# EAGLE design H1BR6 (EAGLE 9.6.1)

## Sheet 1 of 2
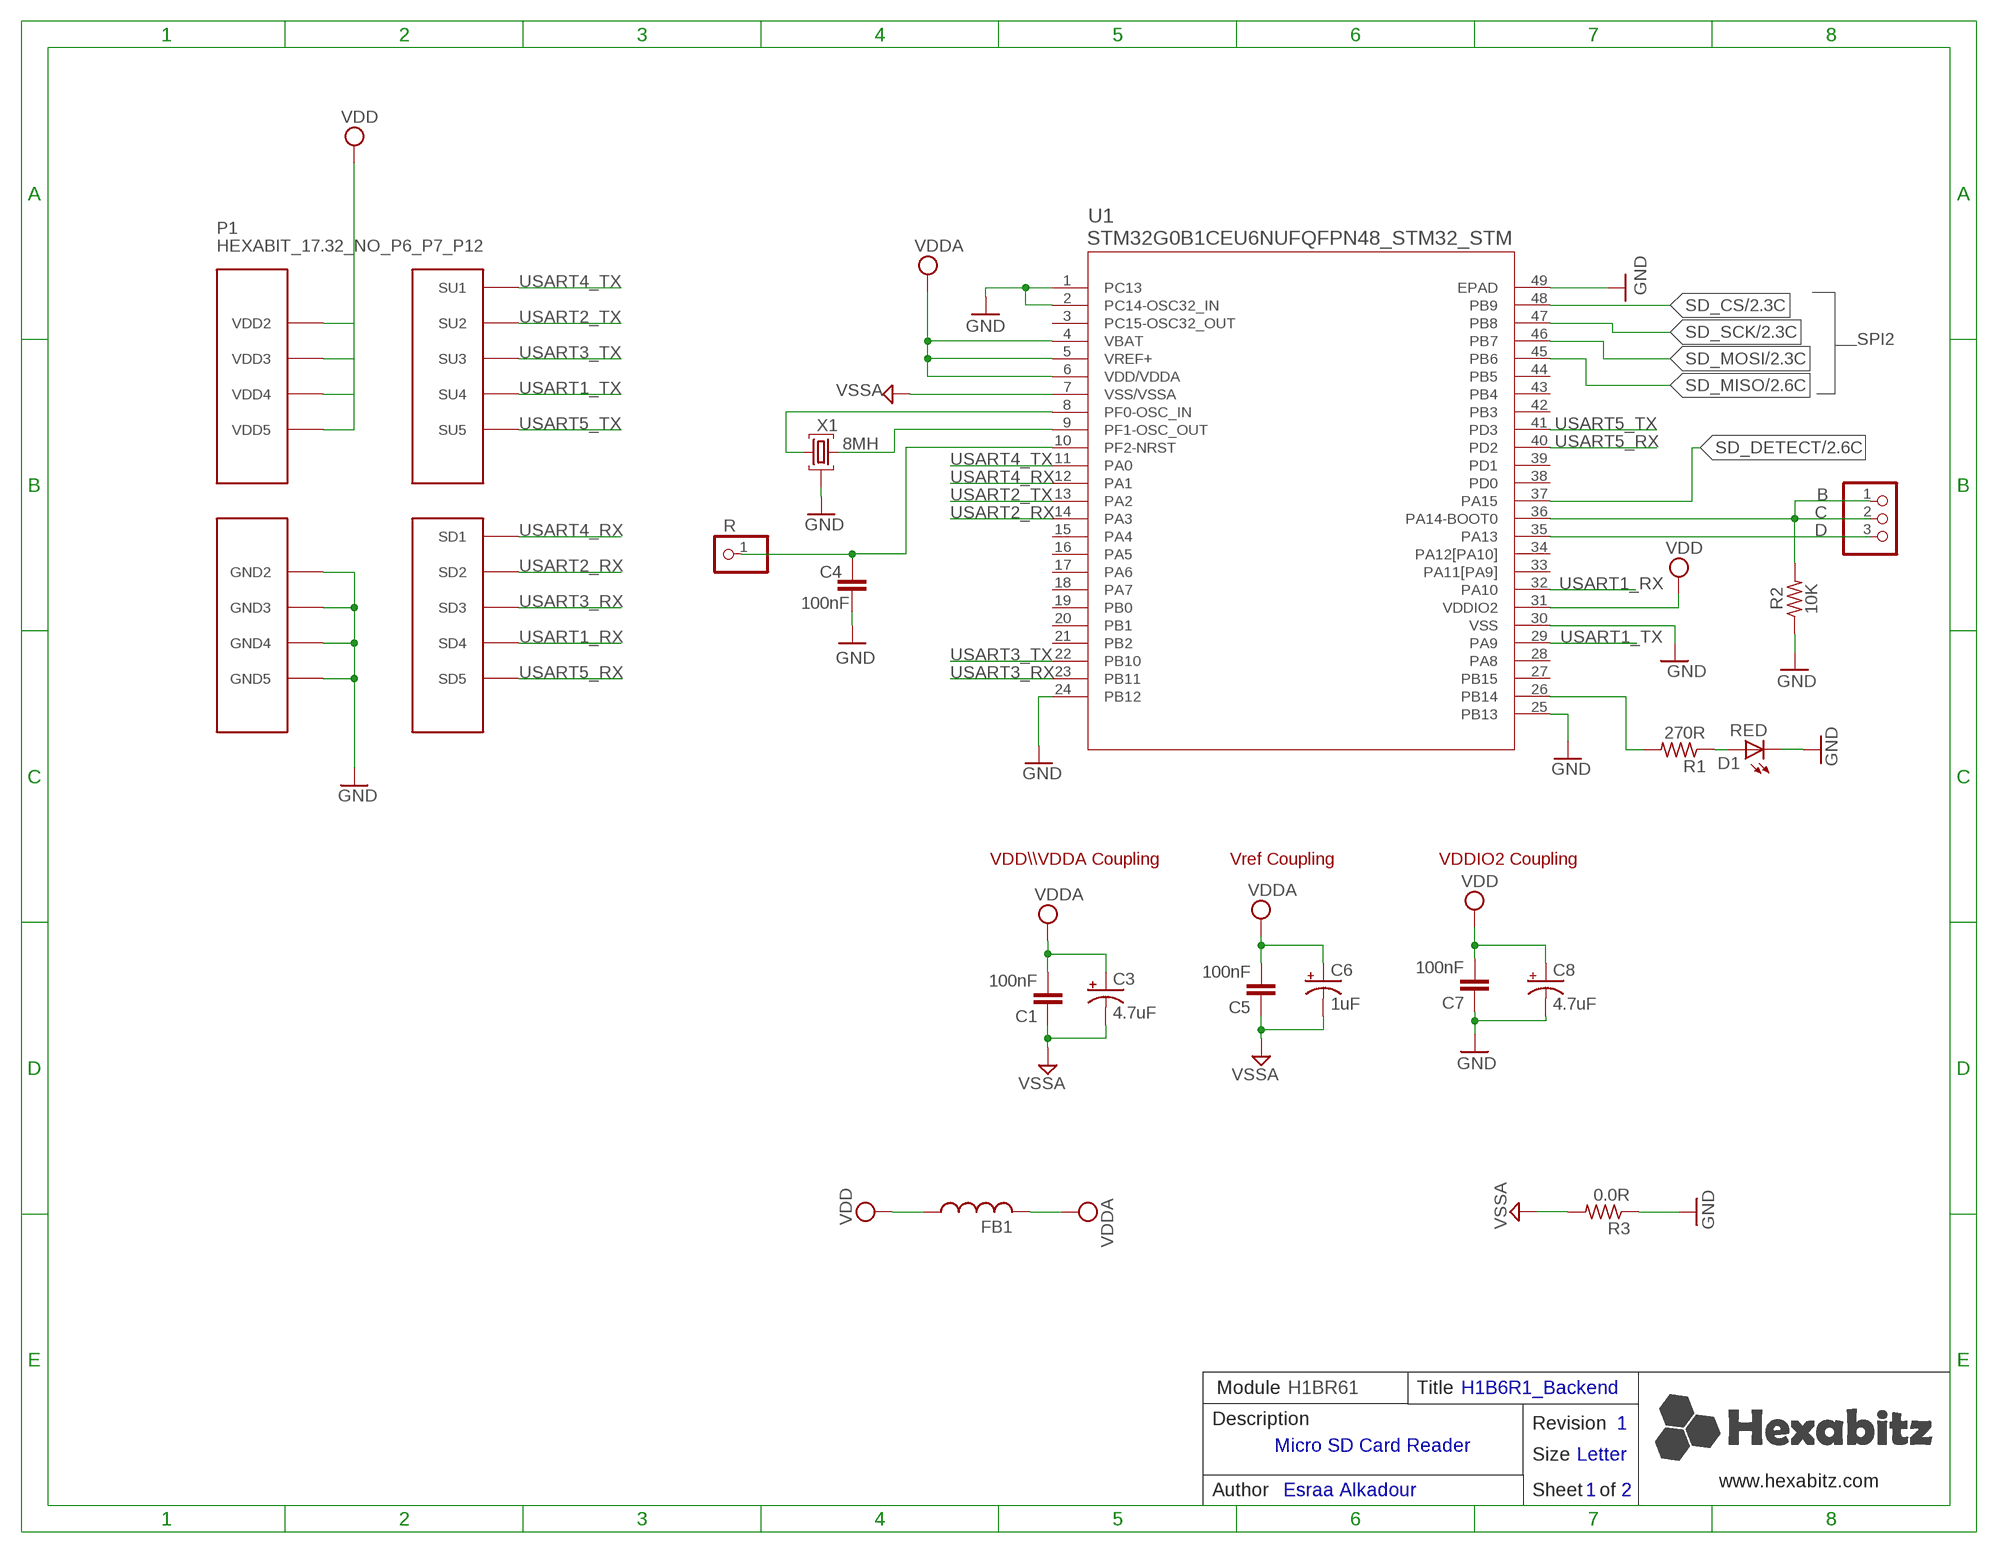
[diagram p0: schematic, sheet 1]

### Parts
C1  100nF  C-0603  [C-0603]
C3  4.7uF  C-0805-POL  [C-0805-POL]
C4  100nF  C-0603  [C-0603]
C5  100nF  C-0603  [C-0603]
C6  1uF  C-0805-POL  [C-0805-POL]
C7  100nF  C-0603  [C-0603]
C8  4.7uF  C-0805-POL  [C-0805-POL]
D1  RED  VLMS1300-GS08  [VLMS1300-GS08]
FB1  FB-TDK_MMZ1608Y300B  [FB-TDK_MMZ1608Y300B]
J4  PINHD-1X1  [1X01]
JP1  PINHD-1X3  [1X03]
P1  HEXABIT_17.32_NO_P6_P7_P12  [HEXABIT_17.32_NO_P6_P7_P12]
R1  270R  R-0603  [R-0603]
R2  10K  R-0603  [R-0603]
R3  0.0R  R-0603  [R-0603]
U1  STM32G0B1CEU6NUFQFPN48_STM32_STM  [UFQFPN48_STM32_STM]
X1  8MH  XTALL_CSTCE8M00G52  [XTALL_CSTCE8M00G52]

### Nets
C: JP1.1 JP1.2 R2.2 U1.36(PA14-BOOT0)
D: JP1.3 U1.35(PA13)
GND: C4.1 C7.1 C8.2(-) D1.C P1.PAD_PD8(GND2) P1.PAD_PD9(GND3) P1.PAD_PD10(GND4) P1.PAD_PD11(GND5) R2.1 R3.1 U1.1(PC13) U1.2(PC14-OSC32_IN) U1.24(PB12) U1.25(PB13) U1.30(VSS) U1.49(EPAD) X1.P$2 ; also sheet 2
GND1: C1.1 C3.2(-) C5.1 C6.2(-) R3.2 U1.7(VSS/VSSA) ; supply symbol labelled VSSA
N$1: U1.8(PF0-OSC_IN) X1.P$3
N$2: U1.9(PF1-OSC_OUT) X1.P$1
N$17: R1.2 U1.26(PB14)
N$19: D1.A R1.1
R: C4.2 J4.1 U1.10(PF2-NRST)
SD_CS: U1.48(PB9) ; also sheet 2
SD_DETECT: U1.37(PA15) ; also sheet 2
SD_MISO: U1.45(PB6) ; also sheet 2
SD_MOSI: U1.46(PB7) ; also sheet 2
SD_SCK: U1.47(PB8) ; also sheet 2
USART1_RX: P1.PAD_PD4(SD4) U1.32(PA10)
USART1_TX: P1.PAD_PU4(SU4) U1.29(PA9)
USART2_RX: P1.PAD_PD2(SD2) U1.14(PA3)
USART2_TX: P1.PAD_PU2(SU2) U1.13(PA2)
USART3_RX: P1.PAD_PD3(SD3) U1.23(PB11)
USART3_TX: P1.PAD_PU3(SU3) U1.22(PB10)
USART4_RX: P1.PAD_PD1(SD1) U1.12(PA1)
USART4_TX: P1.PAD_PU1(SU1) U1.11(PA0)
USART5_RX: P1.PAD_PD5(SD5) U1.40(PD2)
USART5_TX: P1.PAD_PU5(SU5) U1.41(PD3)
VCC: C1.2 C3.1(+) C5.2 C6.1(+) FB1.2 U1.4(VBAT) U1.5(VREF+) U1.6(VDD/VDDA) ; supply symbol labelled VDDA
VDD: C7.2 C8.1(+) FB1.1 P1.PAD_PU8(VDD2) P1.PAD_PU9(VDD3) P1.PAD_PU10(VDD4) P1.PAD_PU11(VDD5) U1.31(VDDIO2) ; also sheet 2
Unconnected: U1.3(PC15-OSC32_OUT) U1.15(PA4) U1.16(PA5) U1.17(PA6) U1.18(PA7) U1.19(PB0) U1.20(PB1) U1.21(PB2) U1.27(PB15) U1.28(PA8) U1.33(PA11[PA9]) U1.34(PA12[PA10]) U1.38(PD0) U1.39(PD1) U1.42(PB3) U1.43(PB4) U1.44(PB5)

### Notes on the sheet
- SPI2
- B
- R
- VDD\\\VDDA Coupling | Vref Coupling | VDDIO2 Coupling
- Module | H1BR61 | Title | H1B6R1_Backend
- Description | Revision | 1
- Micro SD Card Reader
- Size | Letter
- www.hexabitz.com
- Author | Esraa Alkadour | Sheet   of | 1 | 2
- C:/Users/Admin/Desktop/logodraft.bmp

## Sheet 2 of 2
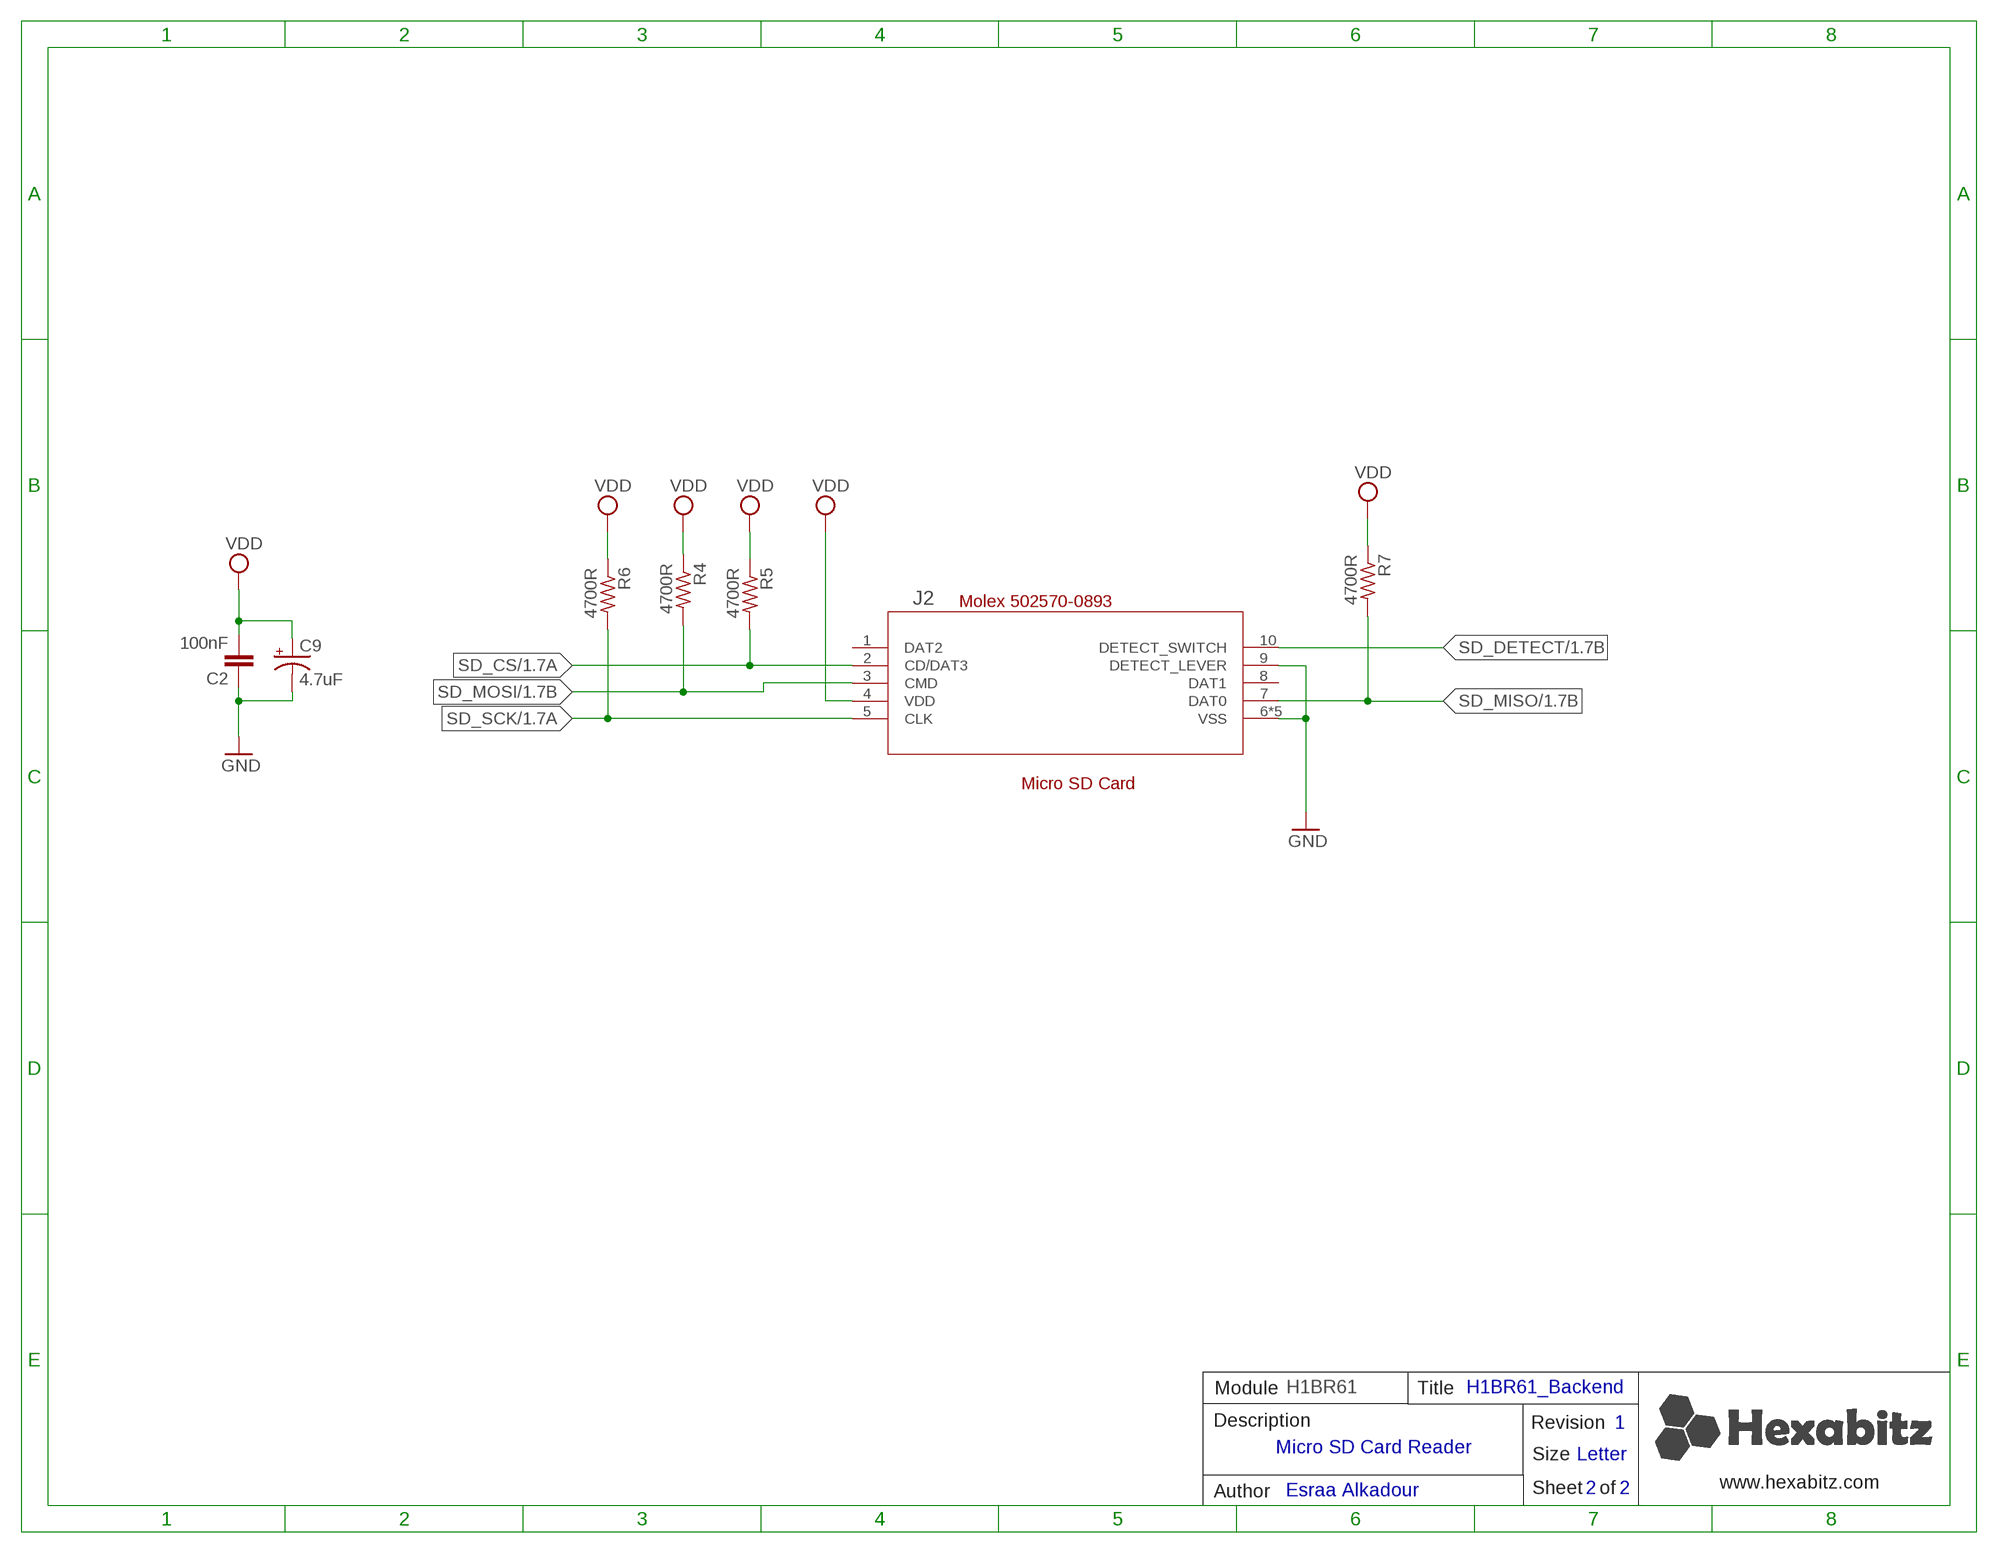
[diagram p1: schematic, sheet 2]

### Parts
C2  100nF  C-0603  [C-0603]
C9  4.7uF  C-0805-POL  [C-0805-POL]
J2  5025700893502570-0893_MOL  [502570-0893_MOL]
R4  4700R  R-0603  [R-0603]
R5  4700R  R-0603  [R-0603]
R6  4700R  R-0603  [R-0603]
R7  4700R  R-0603  [R-0603]

### Nets
GND: C2.1 C9.2(-) J2.6(VSS) J2.9(DETECT_LEVER) J2.11(VSS) J2.12(VSS) J2.13(VSS) J2.14(VSS) ; also sheet 1
SD_CS: J2.2(CD/DAT3) R5.2 ; also sheet 1
SD_DETECT: J2.10(DETECT_SWITCH) ; also sheet 1
SD_MISO: J2.7(DAT0) R7.2 ; also sheet 1
SD_MOSI: J2.3(CMD) R4.2 ; also sheet 1
SD_SCK: J2.5(CLK) R6.2 ; also sheet 1
VDD: C2.2 C9.1(+) J2.4(VDD) R4.1 R5.1 R6.1 R7.1 ; also sheet 1
Unconnected: J2.1(DAT2) J2.8(DAT1)

### Notes on the sheet
- Molex 502570-0893
- Micro SD Card
- Module | H1BR61 | Title | H1BR61_Backend
- Description | Revision | 1
- Micro SD Card Reader
- Size | Letter
- www.hexabitz.com
- Author | Esraa Alkadour | Sheet   of | 2 | 2

## Library data of the parts
C1 C2 C5 C7 = HEXABITZ_RCLS:C-0603: CAP CER 10% X7R 0603; CAPACITANCE: 100nF; MFN: AVX CORPORATION; MPN: '0603YC104K4T2A; OCTOPART_URL: 'https://octopart.com/0603yc104k4t2a-avx+interconnect+%2F+elco-8120651; TOLERANCE: 10%; VOLTAGE_RATING: 16.0 V
C3 C9 = HEXABITZ_RCLS:C-0805-POL: Cap Tant Solid SMD 2012; CAPACITANCE: 4.7uF; MFN: 'Panasonic; MPN: '10TPU4R7MSI; OCTOPART_URL: https://octopart.com/10tpu4r7msi-panasonic-29487748?r=sp; TOLERANCE: 20%; VOLTAGE_RATING: 10.0 V
C4 = HEXABITZ_RCLS:C-0603: CAP CER 10% X7R 0603; CAPACITANCE: 100nF; MFN: AVX CORPORATION; MPN: 0603YC104K4T2A; OCTOPART_URL: 'https://octopart.com/0603yc104k4t2a-avx+interconnect+%2F+elco-8120651; TOLERANCE: 10%; VOLTAGE_RATING: 16.0 V
C6 = HEXABITZ_RCLS:C-0805-POL: Cap Tant Solid SMD 2012; CAPACITANCE: 4.7uF; MFN: 'YAGEO [VA]; MPN: 'CC0805KKX7R7BB105; OCTOPART_URL: 'https://octopart.com/cc0805kkx7r7bb105-yageo-8376555?r=sp; TOLERANCE: 20%; VOLTAGE_RATING: 10.0 V
C8 = HEXABITZ_RCLS:C-0805-POL: Cap Tant Solid SMD 2012; CAPACITANCE: 1.00uF; MFN: 'Panasonic; MPN: '10TPU4R7MSI; OCTOPART_URL: https://octopart.com/10tpu4r7msi-panasonic-29487748?r=sp; TOLERANCE: 10%; VOLTAGE_RATING: 16.0 V
D1 = HEXABITZ_USER_INTERFACE_PARTS:VLMS1300-GS08: Red 0603 130° Clear 54 mcd 2 V Surface Mount ChipLED ; Octopart Url : http://octopart.com/vlms1300-gs08-vishay-21709201; MFN: Vishay; MPN: VLMS1300-GS08; OCTOPART_URL: https://octopart.com/vlms1300-gs08-vishay-21709201?r=sp&s=0nXJNjGsSbWwqfqWlZv0EA
FB1 = HEXABITZ_RCLS:FB-TDK_MMZ1608Y300B: Ferrite Beads Multi-Layer 30Ohm 25% 100MHz 1.5A 50mOhm DCR 0603; MFN: TDK; MPN: MMZ1608Y300BTA00; OCTOPART_URL: https://octopart.com/mmz1608y300bta00-tdk-7906990?r=sp
J2 = HEXABITZ_CONNECTION_PARTS:5025700893; COPYRIGHT: Copyright (C) 2022 Ultra Librarian. All rights reserved.; DIGI-KEY_PART_NUMBER_1: WM19093TR-ND; DIGI-KEY_PART_NUMBER_2: WM19093CT-ND; DIGI-KEY_PART_NUMBER_3: WM19093DKR-ND; DIGI-KEY_PART_NUMBER_4: WM19093TR-NDL; MANUFACTURER_PART_NUMBER: 5025700893; MFR_NAME: Molex Connector Corporation; OCTOPART_URL: https://octopart.com/502570-0893-molex-42270318?r=sp
J4 = HEXABITZ_USER_INTERFACE_PARTS:PINHD-1X1: PIN HEADER; MFN: TE Connectivity; MPN: 87227-1; OCTOPART_URL: https://octopart.com/87227-1-te+connectivity-39512052?r=sp
JP1 = pinhead:PINHD-1X3: PIN HEADER
P1 = hexabitz_connectors:HEXABIT_?_NO_P6_P7_P12: Hexabitz Hexagon Module Connector Hexagon side length = 17.32mm. The following ports are removed: P6 P7 P12
R1 = HEXABITZ_RCLS:R-0603: Thick Film Resistors - SMD 0603; MFN: 'Panasonic; MPN: 'ERJ-3GEYJ271V; OCTOPART_URL: https://octopart.com/erj-3geyj271v-panasonic-55560546?r=sp; RESISTANCE: 270R
R2 = HEXABITZ_RCLS:R-0603: Thick Film Resistors - SMD 0603; MFN: Vishay; MPN: '060300J0103T5E; OCTOPART_URL: https://octopart.com/search?q=060300J0103T5E&currency=USD&specs=0; RESISTANCE: 10K
R3 = HEXABITZ_RCLS:R-0603: Thick Film Resistors - SMD 0603; MFN: YAGEO [VR]; MPN: RC0603JR-070RL; OCTOPART_URL: https://octopart.com/rc0603jr-070rl-yageo-1241539?r=sp; RESISTANCE: 0R
R4-R7 = HEXABITZ_RCLS:R-0603: Thick Film Resistors - SMD 0603; MFN: YAGED [VA]; MPN: RC0603JR-074K7L; OCTOPART_URL: 'https://octopart.com/rc0603jr-074k7l-yageo-55458509?r=sp; RESISTANCE: 4700 Ohm; TOLERANCE: 5%
U1 = HEXABITZ_ICs:STM32G0B1CEU6N; COPYRIGHT: Copyright (C) 2022 Ultra Librarian. All rights reserved.; MFN: STMicroelectronics; MPN: STM32G0B1CEU6N; OCTOPART_URL: https://octopart.com/stm32g0b1ceu6n-stmicroelectronics-116364672?r=sp
X1 = HEXABITZ_OTHER_PARTS:XTALL_CSTCE8M00G52: MURATA CSTCE8M00G52-R0 RESONATOR, SMD, 8MHZ ; Octopart Url : https://octopart.com/cstce8m00g52-r0-murata-7145559; MFN: Murata; MPN: CSTNE8M00G550000R0; OCTOPART_URL: https://octopart.com/cstne8m00g550000r0-murata-91406934?r=sp

## Board
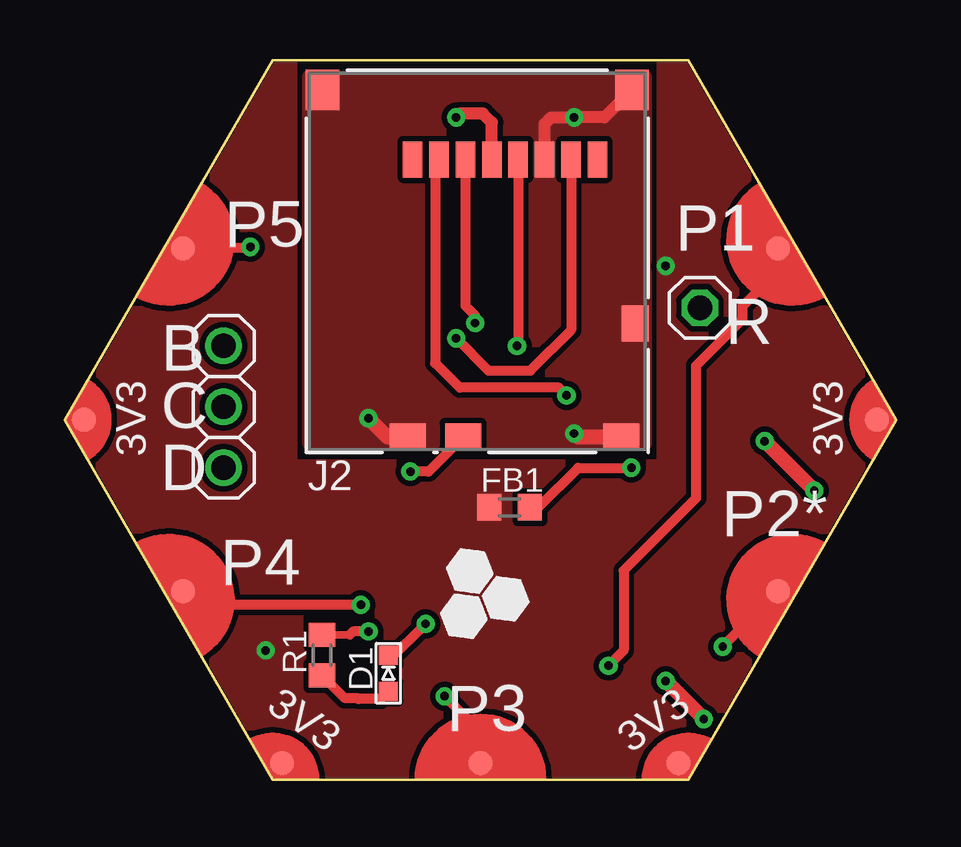
[diagram p2: board, top side]
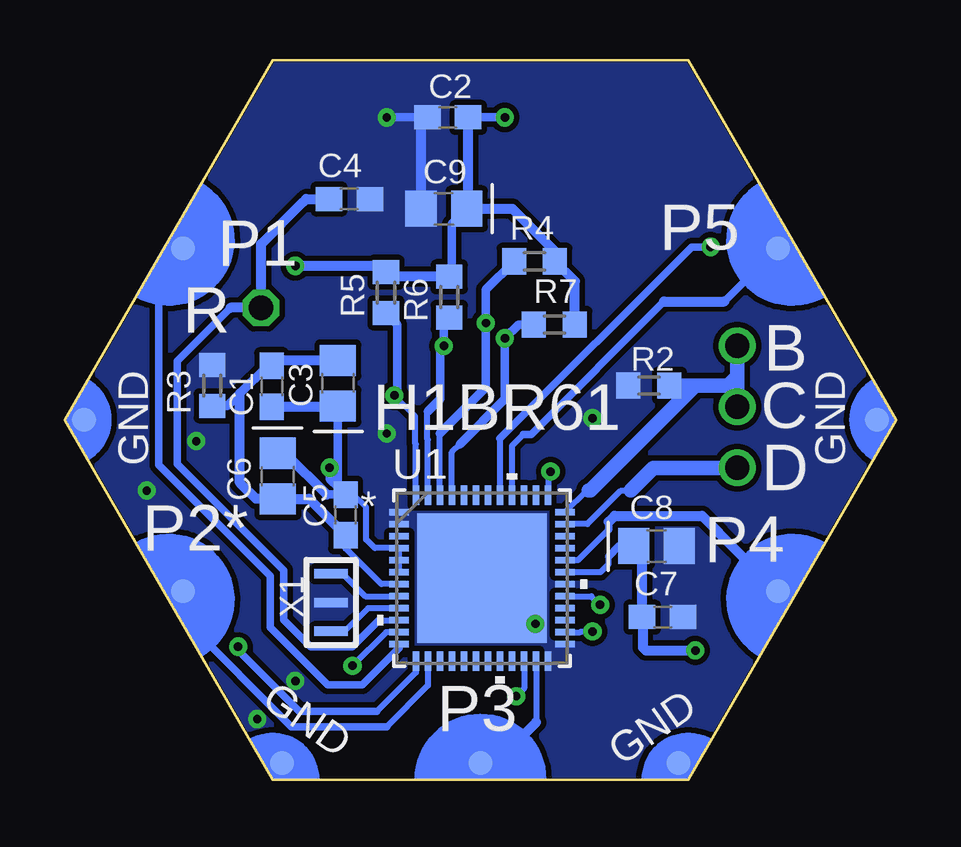
[diagram p3: board, bottom side, seen from below]

Size 34.64 x 30 mm. Coordinates in mm from the lower left corner, seen from the top.
Copper layers (1*16): Top 0.035mm / dielectric 1.5mm / Bottom 0.035mm
Design rules "2_layer *": minimum track width 7mil, minimum drill 10mil, track to track 9mil, track to pad 9mil, pad to pad 9mil, via to via 9mil, smd to smd 0mil, copper to edge 1mil, drill to drill 8mil, minimum pad ring 10mil, minimum via ring 8mil, stop-mask expansion 2mil, vias tented up to drill 15mil, thermal gap 10mil

### Footprints (pad centres in the part's own frame; a part is rotated, then mirrored left to right if it is on the bottom)
C-0603 = smd 1.1 x 1: 1 -0.85,0; 2 0.85,0
C-0805-POL = smd 1.3 x 1.5: 1 -0.95,0; 2 0.95,0
VLMS1300-GS08 = smd 0.8 x 0.8: A 0,0.75; C 0,-0.75
FB-TDK_MMZ1608Y300B = smd 1 x 1.1: 1 -0.85,0; 2 0.85,0
502570-0893_MOL = smd 0.813 x 1.499: 1 -2.7,4.249; 2 -1.6,4.249; 3 -0.5,4.249; 4 0.6,4.249; 5 1.7,4.249; 6 2.8,4.249; 7 3.9,4.249; 8 5,4.249 | smd 1.143 x 1.499: 9 6.575,-2.601 | smd 1.499 x 1.143: 10 -0.6,-7.326; 13 -2.9,-7.326; 14 6,-7.326 | smd 1.397 x 1.702: 11 -6.45,7.149; 12 6.45,7.149
1X01 = drill 1.016 octagon: 1 0,0
1X03 = drill 1.016: 1 -2.54,0; 2 0,0; 3 2.54,0
HEXABIT_17.32_NO_P6_P7_P12 = smd 1 x 1 bottom: PAD_PD1 12.39,7.15; PAD_PD2 12.39,-7.15; PAD_PD3 0,-14.31; PAD_PD4 -12.39,-7.15; PAD_PD5 -12.39,7.15; PAD_PD8 16.52,0; PAD_PD9 8.26,-14.31; PAD_PD10 -8.26,-14.31; PAD_PD11 -16.52,0 | smd 1 x 1: PAD_PU1 12.39,7.15; PAD_PU2 12.39,-7.15; PAD_PU3 0,-14.31; PAD_PU4 -12.39,-7.15; PAD_PU5 -12.39,7.15; PAD_PU8 16.52,0; PAD_PU9 8.26,-14.31; PAD_PU10 -8.26,-14.31; PAD_PU11 -16.52,0
R-0603 = smd 1 x 1.1: 1 -0.85,0; 2 0.85,0
UFQFPN48_STM32_STM = smd 0.813 x 0.254: 1 -3.454,2.751; 2 -3.454,2.251; 3 -3.454,1.75; 4 -3.454,1.25; 5 -3.454,0.75; 6 -3.454,0.25; 7 -3.454,-0.25; 8 -3.454,-0.75; 9 -3.454,-1.25; 10 -3.454,-1.75; 11 -3.454,-2.251; 12 -3.454,-2.751; 25 3.454,-2.751; 26 3.454,-2.251; 27 3.454,-1.75; 28 3.454,-1.25; 29 3.454,-0.75; 30 3.454,-0.25; 31 3.454,0.25; 32 3.454,0.75; 33 3.454,1.25; 34 3.454,1.75; 35 3.454,2.251; 36 3.454,2.751 | smd 0.254 x 0.813: 13 -2.751,-3.454; 14 -2.251,-3.454; 15 -1.75,-3.454; 16 -1.25,-3.454; 17 -0.75,-3.454; 18 -0.25,-3.454; 19 0.25,-3.454; 20 0.75,-3.454; 21 1.25,-3.454; 22 1.75,-3.454; 23 2.251,-3.454; 24 2.751,-3.454; 37 2.751,3.454; 38 2.251,3.454; 39 1.75,3.454; 40 1.25,3.454; 41 0.75,3.454; 42 0.25,3.454; 43 -0.25,3.454; 44 -0.75,3.454; 45 -1.25,3.454; 46 -1.75,3.454; 47 -2.251,3.454; 48 -2.751,3.454 | smd 5.385 x 5.385: 49 0,0
XTALL_CSTCE8M00G52 = smd 1.4 x 0.4: P$1 0,1.2; P$2 0,0; P$3 0,-1.2

### Placement (x,y rotation side)
C1  26.02,16.4 270 bottom
C2  18.69,27.6 0 bottom
C3  23.26,16.52 90 bottom
C4  22.78,24.21 180 bottom
C5  22.94,11.03 90 bottom
C6  25.77,12.65 270 bottom
C7  9.73,6.78 180 bottom
C8  9.99,9.73 0 bottom
C9  18.84,23.79 180 bottom
D1  13.48,4.43 180 top
FB1  18.53,11.35 0 top
J2  17.19,21.6 0 top
J4  26.46,19.67 0 top
JP1  6.62,15.54 270 top
P1  17.32,15 0 top
R1  10.72,5.19 90 top
R2  10.3,16.43 0 bottom
R3  28.5,16.43 270 bottom
R4  15.07,21.6 180 bottom
R5  21.26,20.3 270 bottom
R6  18.62,20.11 270 bottom
R7  14.24,18.97 180 bottom
U1  17.26,8.4 0 bottom
X1  23.54,7.38 180 bottom

### Tracks (layer width: path | path; a pad name or v marks a point on that pad's centre or on a via)
C
  Bottom 0.254: 12.81,12.05 12.9,12.05 U1.36
  Bottom 0.61: JP1.1 6.62,16.81 | 6.62,16.81 JP1.2 | 8.37,16.43 7,16.43 6.62,16.81 | 8.37,16.43 12.75,12.05 12.81,12.05 | R2.2 8.37,16.43
D
  Bottom 0.254: U1.35 12.87,10.65 11.49,12.03 11.08,12.03 11.07,12.05
  Bottom 0.61: JP1.3 10.11,13 11.07,12.05
GND  (via drill 0.35)
  Top 0.406: v15.03,6.49 13.53,4.99 D1.C
  Top 0.508: J2.6 19.99,27.33 20.27,27.61 v21.23,27.61 22.49,27.61 J2.12
  Top 0.61: v31.23,12.05 v29.16,14.11 | v26.62,2.52 v25.04,4.11 | J2.13 13.44,14.28 v12.65,15.06 | J2.14 21.38,14.28 v21.23,14.43
  Bottom 0.305: 19.79,27.35 C2.1
  Bottom 0.356: C2.1 v21.23,27.61
  Bottom 0.406: C9.2 19.79,27.35
  pour Bottom (rank 4, no thermals): 8.64,29.99 25.99,29.99 34.63,15.06 25.96,-0.02 8.64,-0.02 0.07,14.9
  pour Top (no thermals): 10.11,29.35 24.24,29.35 24.24,13.95 10.11,13.95
GND1
  Bottom 0.254: C5.1 22.94,9.63 21.45,8.15 U1.7
  Bottom 0.356: 25.79,17.47 C1.1 26.19,17.25 27.34,16.1 27.86,15.58 R3.2
  Bottom 0.406: C3.2 25.79,17.47 | C5.1 24.46,11.7 C6.2 26.67,11.7 27.34,12.37 27.34,16.1
N$1
  Bottom 0.254: X1.P$3 23.05,8.58 22.11,7.65 U1.8
N$2
  Bottom 0.254: X1.P$1 22.97,6.17 22,7.15 U1.9
N$17  (via drill 0.35)
  Top 0.305: 11.88,6.04 R1.2
  Top 0.406: v12.65,6.17 12.02,6.17 11.88,6.04
  Bottom 0.254: U1.26 13.16,6.15 13.13,6.17 v12.65,6.17
N$19
  Top 0.305: 13.16,3.36 D1.A | 12.23,3.36 12.18,3.39
  Top 0.406: 12.18,3.39 11.67,3.39 R1.1 | 13.16,3.36 12.23,3.36
R
  Bottom 0.254: 21.55,6.64 21.55,6.65 U1.10
  Bottom 0.305: 27.73,19.67 29.96,17.45 29.96,13.16 25.51,8.71 25.51,6.65 24.4,5.54 22.65,5.54 21.55,6.64 | 24.7,24.09 24.58,24.21
  Bottom 0.406: 27.73,19.67 J4.1 26.46,22.33 24.7,24.09 | 24.58,24.21 C4.2
SD_CS  (via drill 0.35)
  Top 0.305: J2.2 15.43,25.69
  Top 0.406: 15.43,25.69 15.43,17.36 16.46,16.33 20.59,16.33 v20.91,16.02
  Bottom 0.254: U1.48 20.01,13.99 20.04,14.02 20.04,15.15 v20.91,16.02
  Bottom 0.356: R5.2 20.78,18.98 20.78,16.14 v20.91,16.02
SD_DETECT  (via drill 0.35)
  Top 0.406: J2.10 15.16,12.84 v14.4,12.84
  Bottom 0.254: v14.4,12.84 14.51,12.73 U1.37
SD_MISO  (via drill 0.35)
  Top 0.406: J2.7 21.09,18.74 19.4,17.05 17.65,17.05 v16.3,18.4
  Bottom 0.254: U1.45 18.51,13.65 18.19,13.97
  Bottom 0.356: R7.2 15.73,18.97 v16.3,18.4 16.3,15.86 18.19,13.97
SD_MOSI  (via drill 0.35)
  Top 0.406: v17.1,19.03 17.1,19.35 16.69,19.75 J2.3
  Bottom 0.254: U1.46 19.01,14.42
  Bottom 0.356: 19.01,14.42 17.1,16.33 v17.1,19.03 17.1,20.42 R4.2
SD_SCK  (via drill 0.35)
  Top 0.305: 18.89,18.13 v18.84,18.08
  Top 0.406: J2.5 18.89,18.13
  Bottom 0.254: 18.99,17.93 v18.84,18.08 | 18.84,19.04 R6.2 | U1.47 19.51,14.17 19.54,14.2 19.54,15.32 19.51,15.35
  Bottom 0.356: 18.99,17.93 18.99,15.87 19.51,15.35 | v18.84,18.08 18.84,19.04
USART1_RX
  Bottom 0.254: 7.39,10.31 7.39,10.28 | U1.32 13.26,9.15 11.98,10.42
  Bottom 0.305: P1.PAD_PD4 4.93,7.92 5.03,7.92 | 11.98,10.42 11.98,10.74
  Bottom 0.406: 7.39,10.31 8.08,10.99 11.73,10.99 11.98,10.74 | 7.39,10.28 5.03,7.92
USART1_TX  (via drill 0.35)
  Top 0.305: P1.PAD_PU4 5.03,7.85 5.6,7.29
  Top 0.406: v12.34,7.29 5.6,7.29
  Bottom 0.254: U1.29 12.7,7.65 v12.34,7.29
USART2_RX
  Bottom 0.254: 29.51,6.52 29.71,6.87 P1.PAD_PD2 | U1.14 19.51,3.92 21.23,2.21
  Bottom 0.305: 21.23,2.21 25.19,2.21 29.51,6.52
USART2_TX  (via drill 0.35)
  Top 0.305: v27.42,5.54 27.42,5.56
  Top 0.406: 27.42,5.56 P1.PAD_PU2
  Bottom 0.254: v27.42,5.54 27.42,5.38 | U1.13 20.01,4.47 21.63,2.84
  Bottom 0.305: 27.42,5.38 24.88,2.84 21.63,2.84
USART3_RX
  Bottom 0.254: 16.78,0.62 17.25,0.62 P1.PAD_PD3 | U1.23 15.01,2.39
  Bottom 0.406: 15.01,2.39 16.78,0.62
USART3_TX  (via drill 0.35)
  Top 0.305: 17.32,1.98 P1.PAD_PU3
  Top 0.406: v15.83,3.48 17.32,1.98
  Bottom 0.254: U1.22 15.51,3.8 v15.83,3.48
USART4_RX
  Bottom 0.254: U1.12 20.71,5.49
  Bottom 0.305: 20.71,5.49 22.25,3.95 23.69,3.95 26.08,6.34 26.08,8.49 30.72,13.12 30.72,21.14 P1.PAD_PD1
USART4_TX  (via drill 0.35)
  Top 0.254: 29.62,22.06 P1.PAD_PU1
  Top 0.305: 29.62,21.11 29.62,22.06
  Top 0.406: v22.65,4.75 23.29,5.38 23.29,8.71 26.3,11.73 26.3,17.26 28.24,19.19 28.24,19.73 29.62,21.11
  Bottom 0.254: U1.11 21.25,6.15 v22.65,4.75
USART5_RX
  Bottom 0.254: 15.53,14.39 16.01,13.91 U1.40
  Bottom 0.305: 7.15,19.93 P1.PAD_PD5 | 15.53,14.39 15.21,14.39 9.68,19.93
  Bottom 0.406: 9.68,19.93 7.15,19.93
USART5_TX  (via drill 0.35)
  Top 0.406: v7.73,22.21 7.67,22.15 P1.PAD_PU5
  Bottom 0.254: 16.51,14.23 U1.41
  Bottom 0.305: 16.51,14.23 8.53,22.21 v7.73,22.21
VCC  (via drill 0.35)
  Top 0.406: FB1.2 19.73,11.35 21.38,13 v23.61,13
  Bottom 0.254: C5.2 22.61,11.88 22.08,11.36 22.08,10.01 21.72,9.65 20.75,9.65 | U1.4 20.75,9.65 | U1.6 U1.5 20.71,9.61 20.75,9.65
  Bottom 0.356: 23.28,15.55 C3.1 23.26,12.2 C5.2 | C6.1 25.45,13.6 | 23.73,11.88 C5.2 | C5.2 23.42,12.36 23.44,12.36 23.61,12.52 v23.61,13
  Bottom 0.406: C1.2 23.28,15.55 | 25.45,13.6 23.73,11.88
VDD  (via drill 0.35)
  Top 0.508: J2.4 17.79,27.39 17.41,27.76 16.46,27.76 v16.3,27.61
  Bottom 0.254: 10.58,9.38 C8.1 11.55,9.73 | U1.31 12.32,8.65 11.98,8.98 11.98,9.3
  Bottom 0.305: 18.53,21.06 R6.1 | C9.1 17.84,23.85 | 21.07,20.96 R5.1 21.52,21.41 | 11.98,9.3 11.55,9.73
  Bottom 0.356: C2.2 v16.3,27.61 | C9.1 18.53,23.16 18.53,21.06 | R4.1 14.22,22.02
  Bottom 0.406: 17.84,23.85 C2.2 | R7.1 13.39,20.78 R4.1 | R6.1 21.07,20.96 | C9.1 15.99,23.8 14.22,22.02 | 21.52,21.41 v25.04,21.41 | 10.58,9.38 C7.2 10.56,6.75 10.56,5.51 10.43,5.38 v8.37,5.38
  pour Top (no thermals): 9.48,29.99 9.48,13.16 24.88,13.16 24.88,29.99 25.99,29.99 34.56,15.06 25.99,-0.02 8.62,-0.02 0.06,14.88 8.64,29.99

### Text on the board
tPlace: P5 | P1 | 3V3 | 3V3 | J2 | P2* | P4 | P3 | 3V3 | 3V3
bPlace: P5 | P1 | GND | H1BR61 | GND | P4 | P2* | P3 | GND | GND
tNames: R | B | C | D
bNames: R | B | C | D